# Altium schematic sheet COVER PAGE.SchDoc
size A3; Date: 09/11/2025; Author: Hung Le; Revision: v1; SheetNumber: 1; SheetTotal: 3; Size: A3
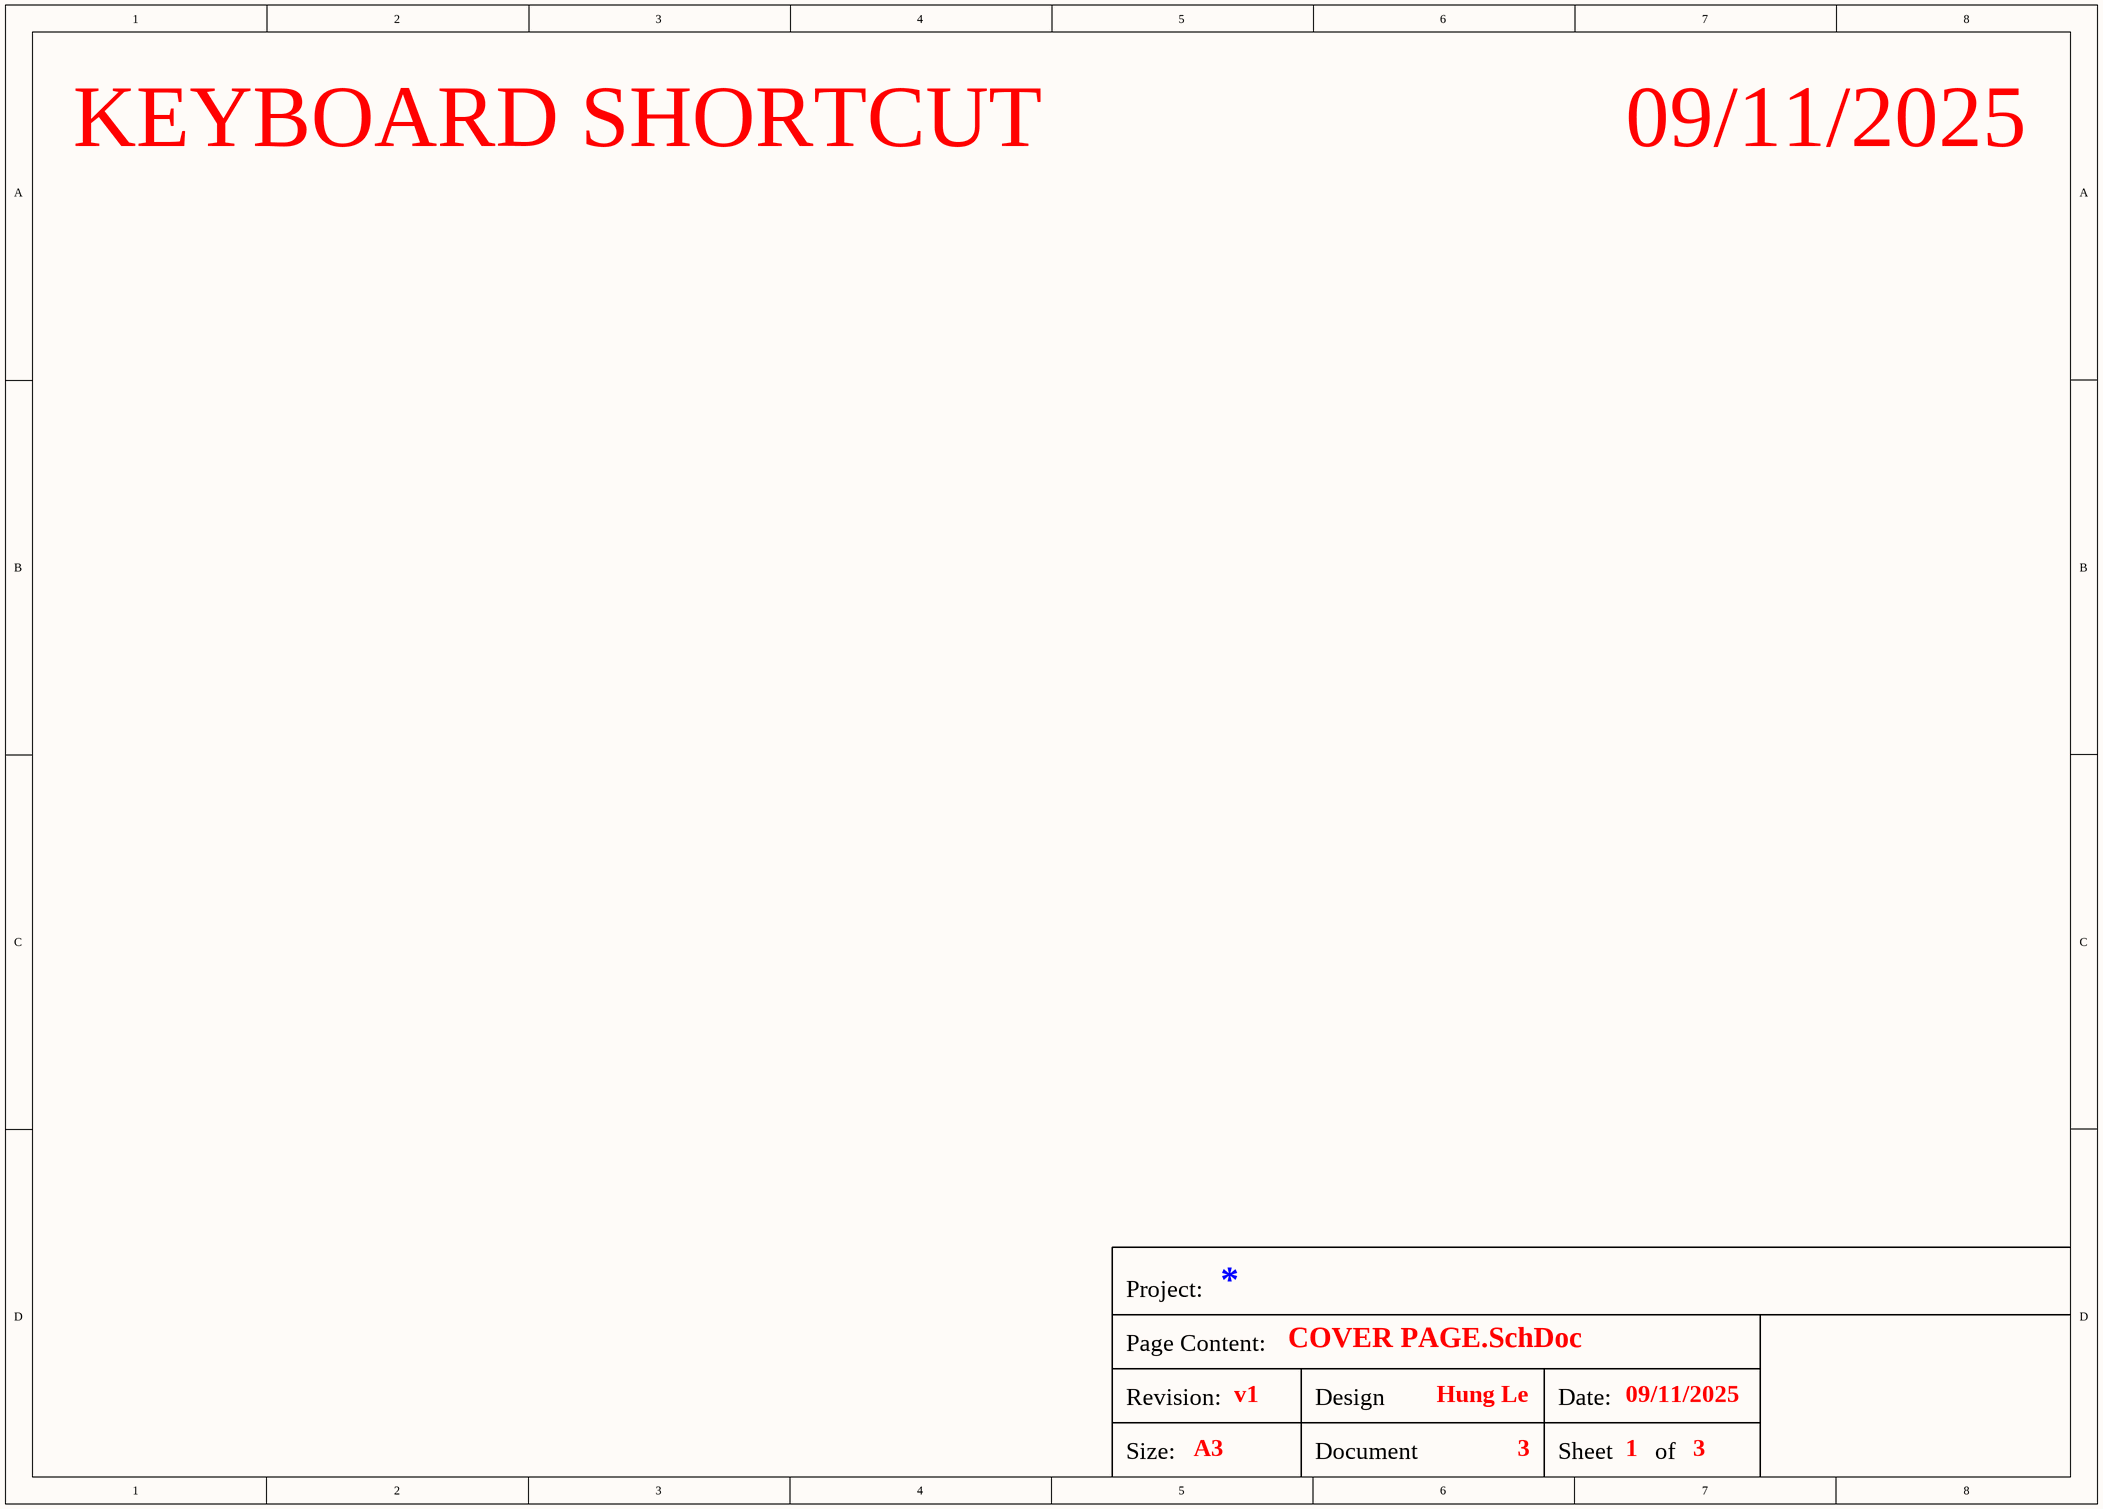
[diagram p0: COVER PAGE.SchDoc]

## Notes on the sheet
- KEYBOARD SHORTCUT
- Project:
- Page Content:
- Revision:
- Size:
- Design by:
- Document number:
- Date:
- Sheet       of